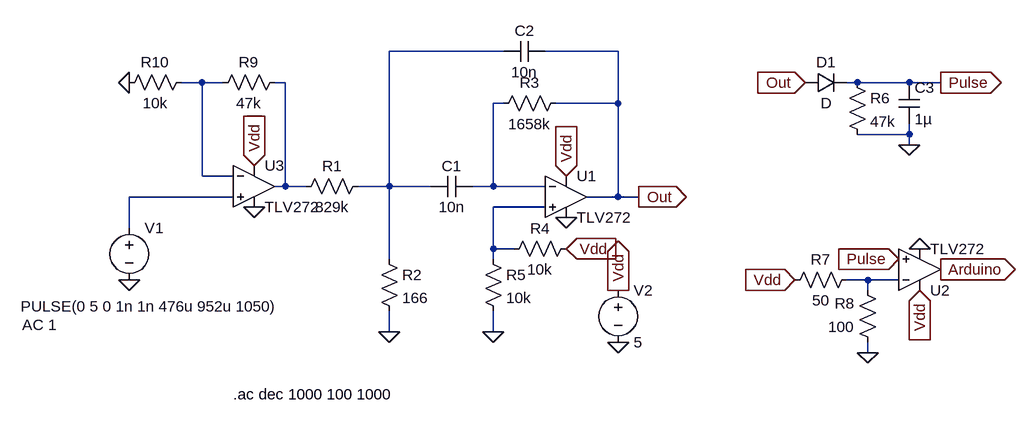
[diagram p0: schematic BPF.asc]
BPF.asc, the LTspice schematic file:
Version 4
SHEET 1 1304 680
WIRE 480 -192 304 -192
WIRE 656 -192 544 -192
WIRE 16 -144 -16 -144
WIRE 48 -144 16 -144
WIRE 144 -144 128 -144
WIRE 1024 -144 1008 -144
WIRE 1104 -144 1024 -144
WIRE 1152 -144 1104 -144
WIRE 480 -112 464 -112
WIRE 656 -112 656 -192
WIRE 656 -112 560 -112
WIRE 1104 -64 1104 -80
WIRE 1104 -64 1024 -64
WIRE 1104 -48 1104 -64
WIRE 16 0 16 -144
WIRE 64 0 16 0
WIRE 144 16 144 -144
WIRE 144 16 128 16
WIRE 176 16 144 16
WIRE 304 16 304 -192
WIRE 304 16 256 16
WIRE 368 16 304 16
WIRE 464 16 464 -112
WIRE 464 16 432 16
WIRE 544 16 464 16
WIRE 64 32 -96 32
WIRE 656 32 656 -112
WIRE 656 32 608 32
WIRE 688 32 656 32
WIRE 544 48 464 48
WIRE -96 80 -96 32
WIRE 464 112 464 48
WIRE 496 112 464 112
WIRE 304 128 304 16
WIRE 464 128 464 112
WIRE 1040 160 1008 160
WIRE 1088 160 1040 160
WIRE 1040 176 1040 160
WIRE 304 240 304 208
WIRE 464 240 464 208
WIRE 1040 272 1040 256
FLAG 576 64 0
FLAG -96 160 0
FLAG 656 176 Vdd
IOPIN 656 176 Out
FLAG 576 0 Vdd
IOPIN 576 0 In
FLAG 576 112 Vdd
IOPIN 576 112 In
FLAG 656 256 0
FLAG 688 32 Out
IOPIN 688 32 Out
FLAG 944 -144 Out
IOPIN 944 -144 In
FLAG 1104 -48 0
FLAG 1152 -144 Pulse
IOPIN 1152 -144 Out
FLAG 1120 112 0
FLAG 1088 128 Pulse
IOPIN 1088 128 In
FLAG 1040 272 0
FLAG 928 160 Vdd
IOPIN 928 160 In
FLAG 1120 176 Vdd
IOPIN 1120 176 In
FLAG 1152 144 Arduino
IOPIN 1152 144 Out
FLAG 304 240 0
FLAG 464 240 0
FLAG 96 -16 Vdd
IOPIN 96 -16 In
FLAG 96 48 0
FLAG -96 -144 0
SYMBOL voltage -96 64 R0
WINDOW 3 -167 137 Left 2
WINDOW 123 -165 165 Left 2
WINDOW 39 0 0 Left 0
SYMATTR Value PULSE(0 5 0 1n 1n 476u 952u 1050)
SYMATTR Value2 AC 1
SYMATTR InstName V1
SYMBOL res 272 0 R90
WINDOW 0 0 56 VBottom 2
WINDOW 3 32 56 VTop 2
SYMATTR InstName R1
SYMATTR Value 829k
SYMBOL res 288 112 R0
SYMATTR InstName R2
SYMATTR Value 166
SYMBOL res 576 -128 R90
WINDOW 0 0 56 VBottom 2
WINDOW 3 32 56 VTop 2
SYMATTR InstName R3
SYMATTR Value 1658k
SYMBOL res 592 96 R90
WINDOW 0 0 56 VBottom 2
WINDOW 3 32 56 VTop 2
SYMATTR InstName R4
SYMATTR Value 10k
SYMBOL cap 432 0 R90
WINDOW 0 0 32 VBottom 2
WINDOW 3 32 32 VTop 2
SYMATTR InstName C1
SYMATTR Value 10n
SYMBOL cap 544 -208 R90
WINDOW 0 0 32 VBottom 2
WINDOW 3 32 32 VTop 2
SYMATTR InstName C2
SYMATTR Value 10n
SYMBOL res 448 112 R0
SYMATTR InstName R5
SYMATTR Value 10k
SYMBOL Misc\\TLV272 576 32 R0
SYMATTR InstName U1
SYMBOL voltage 656 160 R0
SYMATTR InstName V2
SYMATTR Value 5
SYMBOL diode 944 -128 R270
WINDOW 0 32 32 VTop 2
WINDOW 3 0 32 VBottom 2
SYMATTR InstName D1
SYMBOL res 1008 -160 R0
SYMATTR InstName R6
SYMATTR Value 47k
SYMBOL cap 1088 -144 R0
SYMATTR InstName C3
SYMATTR Value 1µ
SYMBOL Misc\\TLV272 1120 144 M180
SYMATTR InstName U2
SYMBOL res 1024 144 R90
WINDOW 0 0 56 VBottom 2
WINDOW 3 32 56 VTop 2
SYMATTR InstName R7
SYMATTR Value 50
SYMBOL res 1056 272 R180
WINDOW 0 36 76 Left 2
WINDOW 3 36 40 Left 2
SYMATTR InstName R8
SYMATTR Value 100
SYMBOL Misc\\TLV272 96 16 R0
SYMATTR InstName U3
SYMBOL res 144 -160 R90
WINDOW 0 0 56 VBottom 2
WINDOW 3 32 56 VTop 2
SYMATTR InstName R9
SYMATTR Value 47k
SYMBOL res 0 -160 R90
WINDOW 0 0 56 VBottom 2
WINDOW 3 32 56 VTop 2
SYMATTR InstName R10
SYMATTR Value 10k
TEXT 64 336 Left 2 !.ac dec 1000 100 1000

The netlist it stands for:
* BPF.asc
V1 N005 0 PULSE(0 5 0 1n 1n 476u 952u 1050) AC 1
R1 N001 N003 829k
R2 N001 0 166
R3 Out N004 1658k
R4 Vdd N006 10k
C1 N004 N001 10n
C2 Out N001 10n
R5 N006 0 10k
* U1: TLV272 (symbol Misc\TLV272 not available, pins judged from their places): In+=N006 In-=N004 V+=Vdd V-=0 OUT=Out
V2 Vdd 0 5
D1 Out Pulse D
R6 Pulse 0 47k
C3 Pulse 0 1µ
* U2: TLV272 (symbol Misc\TLV272 not available, pins judged from their places): In+=Pulse In-=N007 V+=Vdd V-=0 OUT=Arduino
R7 N007 Vdd 50
R8 0 N007 100
* U3: TLV272 (symbol Misc\TLV272 not available, pins judged from their places): In+=N005 In-=N002 V+=Vdd V-=0 OUT=N003
R9 N003 N002 47k
R10 N002 0 10k
.model D D
.lib standard.dio
.ac dec 1000 100 1000
.backanno
.end